# Altium project RS485-CAN.PrjPcb
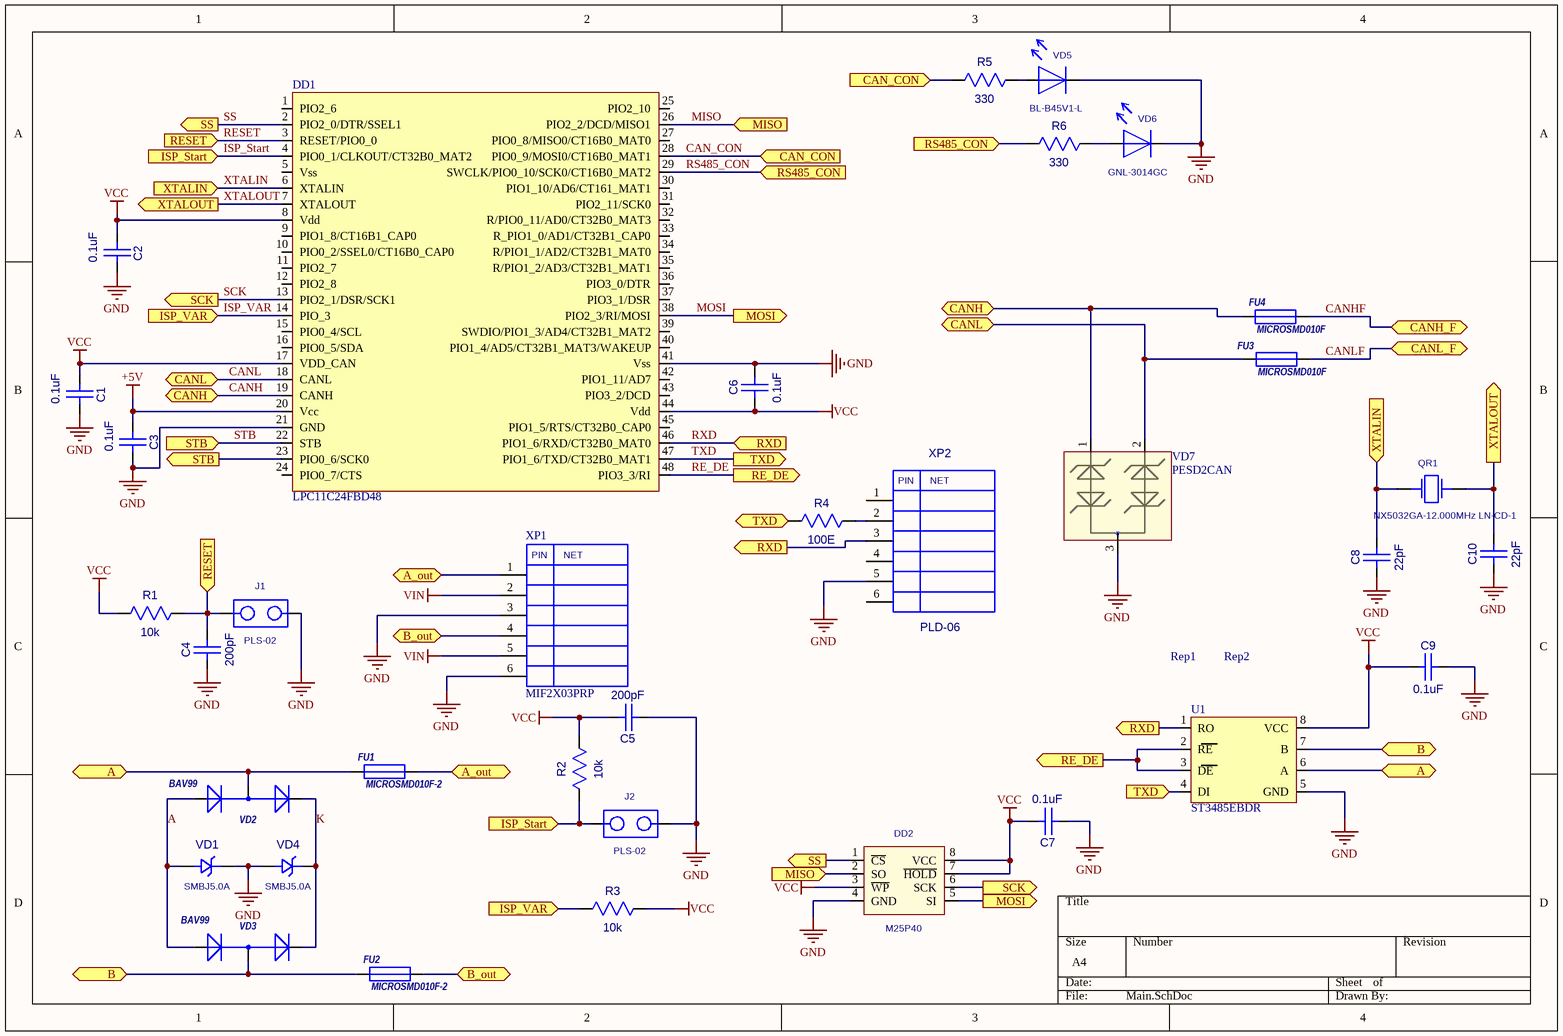
[diagram p0: Main.SchDoc]
2 sheets, 67 parts. Net scope: flat (ports and power ports of the same name join across sheets).
Board file: RS485-CAN.PcbDoc
Sheets:
  Main.SchDoc
  Power.SchDoc

## Sheet Main.SchDoc
size A4

### Parts
C1  0.1uF  [CC0603-3M]
C2  0.1uF  [CC0603-3M]
C3  0.1uF  [CC0603-3M]
C4  200pF  [CC0603-3M]
C5  200pF  [CC0603-3M]
C6  0.1uF  [CC0603-3M]
C7  0.1uF  [CC0603-3M]
C8  22pF  [CC0603-3M]
C9  0.1uF  [CC0603-3M]
C10  22pF  [CC0603-3M]
DD1  LPC11C24FBD48  [LQFP48]
DD2  M25P40  [EIAJ_SO8]
FU1  MICROSMD010F-2  [RC1210]
FU2  MICROSMD010F-2  [RC1210]
FU3  MICROSMD010F  [RC1210]
FU4  MICROSMD010F  [RC1210]
J1  PLS-02  [PIN2W]
J2  PLS-02  [PLS-02]
QR1  NX5032GA-12.000MHz LN-CD-1  [AC5032_2]
R1  10k  [RC0603-3M]
R2  10k  [RC0603-3M]
R3  10k  [RC0603-3M]
R4  100E  [RC0603-3M]
R5  330  [RC0603-3M]
R6  330  [RC0603-3M]
Rep1  REPER1.2  [REPER1.2]  (value not drawn)
Rep2  REPER1.2  [REPER1.2]  (value not drawn)
U1  ST3485EBDR  [SO-8]
VD1  SMBJ5.0A  [SMB]
VD2  BAV99  [SOT-23(GSD)]
VD3  BAV99  [SOT-23(GSD)]
VD4  SMBJ5.0A  [SMB]
VD5  BL-B45V1-L  [LED3]
VD6  GNL-3014GC  [LED3]
VD7  PESD2CAN  [SOT-23(123)]
XP1  MIF2X03PRP  [MIF2X03PRP]
XP2  PLD-06  [PIN6]

### Ports
A (bidir), A_out, B (bidir), B_out, CAN_CON (in), CANH, CANH_F, CANL, CANL_F, ISP_Start (in), ISP_VAR (in), MISO (in), MOSI (out), RE_DE (out), RESET (in), RS485_CON (in), RXD (in), RXD (out), SCK (out), SS (out), STB (in), STB (out), TXD (in), TXD (out), XTALIN (in), XTALOUT (out)

### Nets
+5V: C3.1(A) DD1.20(Vcc)
GND: C1.2(B) C2.2(B) C3.2(B) C4.1(A) C5.1(A) C6.2(B) C7.1(A) C8.1(A) C9.2(B) C10.1(A) DD1.21(GND) DD1.41(Vss) DD2.4(GND) J1.2 J2.2 U1.5(GND) VD1.2(K) VD4.1(A) VD5.1 VD6.1 VD7.3 XP1.3 XP1.6 XP2.5
VCC: C1.1(A) C2.1(A) C5.2(B) C6.1(A) C7.2(B) C9.1(A) DD1.8(Vdd) DD1.17(VDD_CAN) DD1.44(Vdd) DD2.3(~{WP}) DD2.7(~{HOLD}) DD2.8(VCC) R1.1(A) R2.2(B) R3.2(B) U1.8(VCC)
VIN: XP1.2 XP1.5
A: VD1.1(A) VD2.1(A) VD3.1(A)
CAN_CON: DD1.28(PIO0_9/MOSI0/CT16B0_MAT1) R5.1(A) ; port CAN_CON
CANH: DD1.19(CANH) FU4.1 VD7.1 ; port CANH
CANHF: FU4.2 ; port CANH_F
CANL: DD1.18(CANL) FU3.1 VD7.2 ; port CANL
CANLF: FU3.2 ; port CANL_F
ISP_Start: DD1.4(PIO0_1/CLKOUT/CT32B0_MAT2) J2.1 R2.1(A) ; port ISP_Start
ISP_VAR: DD1.14(PIO_3) R3.1(A) ; port ISP_VAR
K: VD2.2(K) VD3.2(K) VD4.2(K)
MISO: DD1.26(PIO2_2/DCD/MISO1) DD2.2(SO) ; port MISO
MOSI: DD1.38(PIO2_3/RI/MOSI) DD2.5(SI) ; port MOSI
RE_DE: DD1.48(PIO3_3/RI) U1.2(RE) U1.3(DE) ; port RE_DE
RESET: C4.2(B) DD1.3(RESET/PIO0_0) J1.1 R1.2(B) ; port RESET
RS485_CON: DD1.29(SWCLK/PIO0_10/SCK0/CT16B0_MAT2) R6.1(A) ; port RS485_CON
RXD: DD1.46(PIO1_6/RXD/CT32B0_MAT0) U1.1(RO) XP2.3 ; port RXD
SCK: DD1.13(PIO2_1/DSR/SCK1) DD2.6(SCK) ; port SCK
SS: DD1.2(PIO2_0/DTR/SSEL1) DD2.1(~{CS}) ; port SS
STB: DD1.22(STB) DD1.23(PIO0_6/SCK0) ; port STB
TXD: DD1.47(PIO1_6/TXD/CT32B0_MAT1) R4.1(A) U1.4(DI) ; port TXD
XTALIN: C8.2(B) DD1.6(XTALIN) QR1.1 ; port XTALIN
XTALOUT: C10.2(B) DD1.7(XTALOUT) QR1.2 ; port XTALOUT
NetFU1_1: FU1.1 U1.6(A) VD2.3(AK) ; port A
NetFU1_2: FU1.2 XP1.1 ; port A_out
NetFU2_1: FU2.1 U1.7(B) VD3.3(AK) ; port B
NetFU2_2: FU2.2 XP1.4 ; port B_out
NetR4_2: R4.2(B) XP2.2
NetR5_2: R5.2(B) VD5.2
NetR6_2: R6.2(B) VD6.2

Not connected (* = marked no-connect by the designer): DD1 1(PIO2_6) 5(Vss) 9(PIO1_8/CT16B1_CAP0) 10(PIO0_2/SSEL0/CT16B0_CAP0) 11(PIO2_7) 12(PIO2_8) 15(PIO0_4/SCL) 16(PIO0_5/SDA) 24(PIO0_7/CTS) 25(PIO2_10) 27(PIO0_8/MISO0/CT16B0_MAT0) 30(PIO1_10/AD6/CT161_MAT1) 31(PIO2_11/SCK0) 32(R/PIO0_11/AD0/CT32B0_MAT3) 33(R_PIO1_0/AD1/CT32B1_CAP0) 34(R/PIO1_1/AD2/CT32B1_MAT0) 35(R/PIO1_2/AD3/CT32B1_MAT1) 36(PIO3_0/DTR) 37(PIO3_1/DSR) 39(SWDIO/PIO1_3/AD4/CT32B1_MAT2) 40(PIO1_4/AD5/CT32B1_MAT3/WAKEUP) 42(PIO1_11/AD7) 43(PIO3_2/DCD) 45(PIO1_5/RTS/CT32B0_CAP0); Rep1 1; Rep2 1; XP2 1 4 6

### Notes on the sheet
- (in symbol MIF2X03PRP) PIN; NET
- (in symbol PLD-06) PIN; NET

### Library data of the parts
C1-C10 = CC0603
  C1-C3 C6 C7 C9: Value: 0.1uF
  C4 C5: Value: 200pF
  C8 C10: Value: 22pF
DD2 = S25FL016A0LMFI01: Value: M25P40
FU1-FU4 = MICROSMD
  FU1 FU2: Value: *
  FU3 FU4: Value: MICROSMD010F
QR1 = AC5032_2: AC5032/2; Value: NX5032GA-12.000MHz LN-CD-1
R1-R6 = RC0603
  R1-R3: Value: 10k
  R4: Value: 100E
  R5 R6: Value: 330
VD1 VD4 = SMBJ: Value: SMBJ5.0A
VD2 VD3 = BAV99: 1.0 Ampere General Purpose Rectifier; ComponentField6: Published 8-Jun-2000, Modified 11-July-2000: SIM Model Added.; Value: *
VD5 VD6 = LED_3
  VD5: Value: BL-B45V1-L
  VD6: Value: GNL-3014GC
VD7 = PESD2CAN: TVS for CAN
XP2 = PLD-06: PLD06; Value: *
DD1 = LPC11C24FBD48: Value: LPC11C24FBD48
J1 J2 = PLS-02
  J1: Value: *
  J2: Value: PLS-02
Rep1 Rep2 = REPER1.2: Value: *
U1 = ST3485EBDR: Value: ST3485EBDR
XP1 = MIF2X03PRP: Value: *

## Sheet Power.SchDoc
size A4
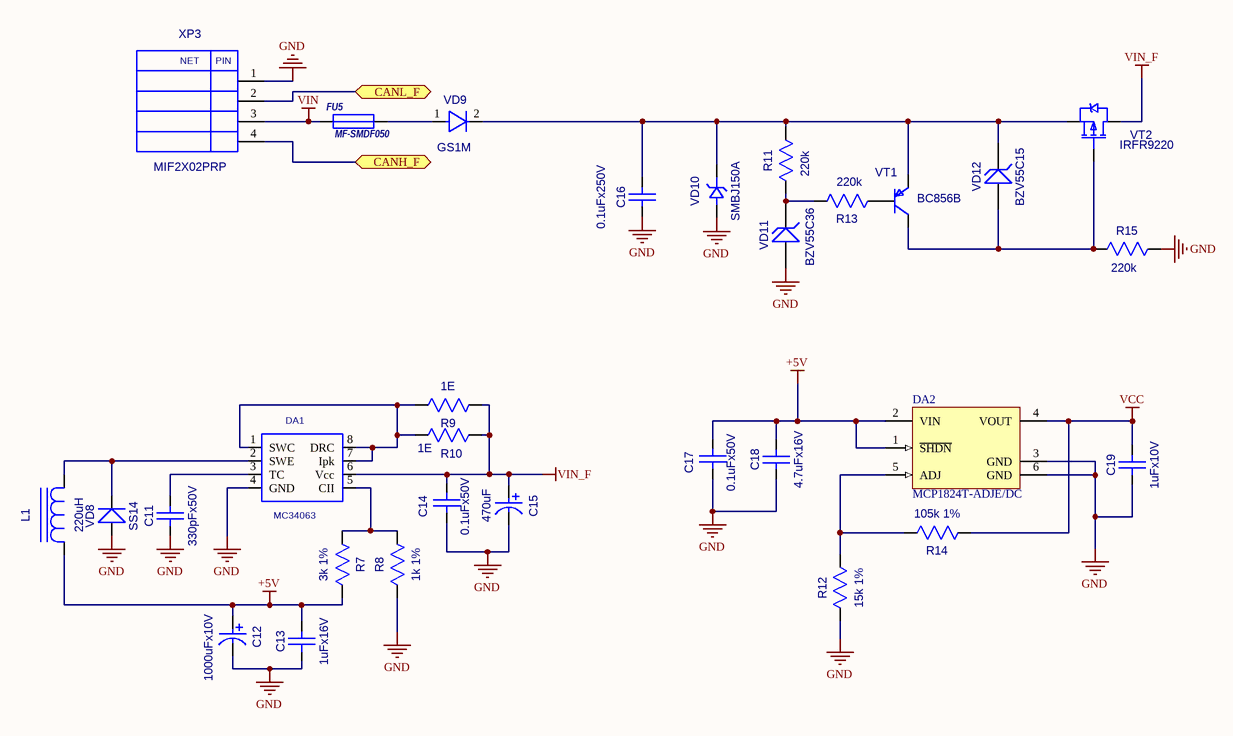
[diagram p1: Power.SchDoc]

### Parts
C11  330pFx50V  [CC0603-3M]
C12  1000uFx10V  [CC8X3.5]
C13  1uFx16V  [CC0603-3M]
C14  0.1uFx50V  [CC0603-3M]
C15  470uF  [CC16X10_CAP0.5(1)(Primary)]
C16  0.1uFx250V  [CC1206-MIDI]
C17  0.1uFx50V  [CC0603-3M]
C18  4.7uFx16V  [CC0805-MIDI-2M1]
C19  1uFx10V  [CC0603-3M]
DA1  MC34063  [SO-8]
DA2  MCP1824T-ADJE/DC  [SOT223-6]
FU5  MF-SMDF050  [MF-SMDF]
L1  220uH  [SDR0805]
R7  3k 1%  [RC0603-3M]
R8  1k 1%  [RC0603-3M]
R9  1E  [RC0805_IPC_NOM]
R10  1E  [RC0805_IPC_NOM]
R11  220k  [RC1206-2M]
R12  15k 1%  [RC0603-3M]
R13  220k  [RC1206-2M]
R14  105k 1%  [RC0603-3M]
R15  220k  [RC1206-2M]
VD8  SS14  [SMA]
VD9  GS1M  [SMA]
VD10  SMBJ150A  [SMB]
VD11  BZV55C36  [SOD-80]
VD12  BZV55C15  [SOD-80]
VT1  BC856B  [SOT-23(123)]
VT2  IRFR9220  [D-PAK(TO-252AA)]
XP3  MIF2X02PRP  [MIF2X02PRP]

### Ports
CANH_F, CANL_F

### Nets
+5V: C12.1 C13.2(B) C17.1(A) C18.2(B) DA2.1(~{SHDN}) DA2.2(VIN) L1.1(C) R7.2(B)
GND: C11.1(A) C12.2 C13.1(A) C14.2(B) C15.1 C16.1(A) C17.2(B) C18.1(A) C19.1(A) DA1.4(GND) DA2.3(GND) DA2.6(GND) R8.1(A) R12.1(A) R15.2(B) VD8.1(A) VD10.1(A) VD11.1(A) XP3.1
VCC: C19.2(B) DA2.4(VOUT) R14.1(A)
VIN: FU5.1 XP3.3
VIN_F: C14.1(A) C15.2 DA1.6(Vcc) R9.1(A) R10.1(A) VT2.3(D)
CANHF: XP3.4 ; port CANH_F
CANLF: XP3.2 ; port CANL_F
NetC11_2: C11.2(B) DA1.3(TC)
NetC16_2: C16.2(B) R11.2(B) VD9.2(K) VD10.2(K) VD12.2 VT1.2(E) VT2.2(S)
NetDA1_1: DA1.1(SWC) DA1.7(Ipk) DA1.8(DRC) R9.2(B) R10.2(B)
NetDA1_2: DA1.2(SWE) L1.2(A) VD8.2(K)
NetDA1_5: DA1.5(CII) R7.1(A) R8.2(B)
NetDA2_5: DA2.5(ADJ) R12.2(B) R14.2(B)
NetFU5_2: FU5.2 VD9.1(A)
NetR11_1: R11.1(A) R13.2(B) VD11.2
NetR13_1: R13.1(A) VT1.1(B)
NetR15_1: R15.1(A) VD12.1(A) VT1.3(C) VT2.1(G)

### Notes on the sheet
- (in symbol MIF2X02PRP) NET; PIN

### Library data of the parts
C11 C13 C14 C17 C19 = CC0603
  C11: Value: 330pFx50V
  C13: Value: 1uFx16V
  C14 C17: Value: 0.1uFx50V
  C19: Value: 1uFx10V
C12 = CAP0.35: Value: 1000uFx10V
C15 = CAP0.5(1): Value: 470uF
C16 = CC1206: Value: 0.1uFx250V
C18 = CC0805: Value: 4.7uFx16V
DA2 = MCP1824T-ADJE/DC: 300 mA, Low Voltage, Low Quiescent Current LDO Regulator, 5-Pin SOT-223, Extended Temperature, Tape and Reel; Published: 29-Jan-2009; DatasheetVersion: revA, Aug-2007; PackageVersion: revAW, Oct-2008; PackageReference: SOT-223-DC5; Publisher: Altium Limited; PackageDescription: 5-Lead Plastic Small Outline Transistor (DC) [SOT-223]; ComponentLink1Description: Manufacturer Link; ComponentLink1URL: http://www.microchip.com; ComponentLink2Description: Datasheet; ComponentLink2URL: http://ww1.microchip.com/downloads/en/DeviceDoc/22070a.pdf; ComponentLink3Description: Packaging Specification; ComponentLink3URL: http://ww1.microchip.com/downloads/en/PackagingSpec/00049AW.pdf
FU5 = MF-SMDF: Value: MF-SMDF050
L1 = SDR0805: Value: 220uH
R7 R8 R12 R14 = RC0603
  R7: Value: 3k 1%
  R8: Value: 1k 1%
  R12: Value: 15k 1%
  R14: Value: 105k 1%
R9 R10 = RC0805: Value: 1E
R11 R13 R15 = RC1206: Value: 220k
VD8 = SS14: Schottky Rectifier; Value: SS14
VD9 = GS1M: Value: {Value}
VD10 = SMBJ: Value: SMBJ150A
VD11 VD12 = BZV55C12: Zener Voltage Regulator Diode; OriginalName: BZX84C10LT1; ComponentField6: Pin 2 is not connected and not drawn.; ComponentField7: Published 29-Sep-2000
  VD11: Value: BZV55C36
  VD12: Value: BZV55C15
VT1 = BC856B: OriginalName: BC856BLT; ComponentField7: Published 29-Sep-2000; Value: BC856B
VT2 = IRFR9220: HEXFET Power MOSFET; OriginalName: IRLML5103; ComponentField7: Published 8-Jun-2000; Value: IRFR9220
DA1 = MC34063: Value: *
XP3 = MIF2X02PRP: Value: *

## Nets that join several sheets
+5V: Main (C3.1 DD1.20), Power (8 pins)
GND: Main (24 pins), Power (19 pins)
VCC: Main (16 pins), Power (C19.2 DA2.4 R14.1)
VIN: Main (XP1.2 XP1.5), Power (FU5.1 XP3.3)
CANHF: Main (FU4.2), Power (XP3.4)
CANLF: Main (FU3.2), Power (XP3.2)